# EAGLE design seismometer (EAGLE 7.0.0)
Placa Principal TGF-SIS001
AUTHOR: Ivan Pereira
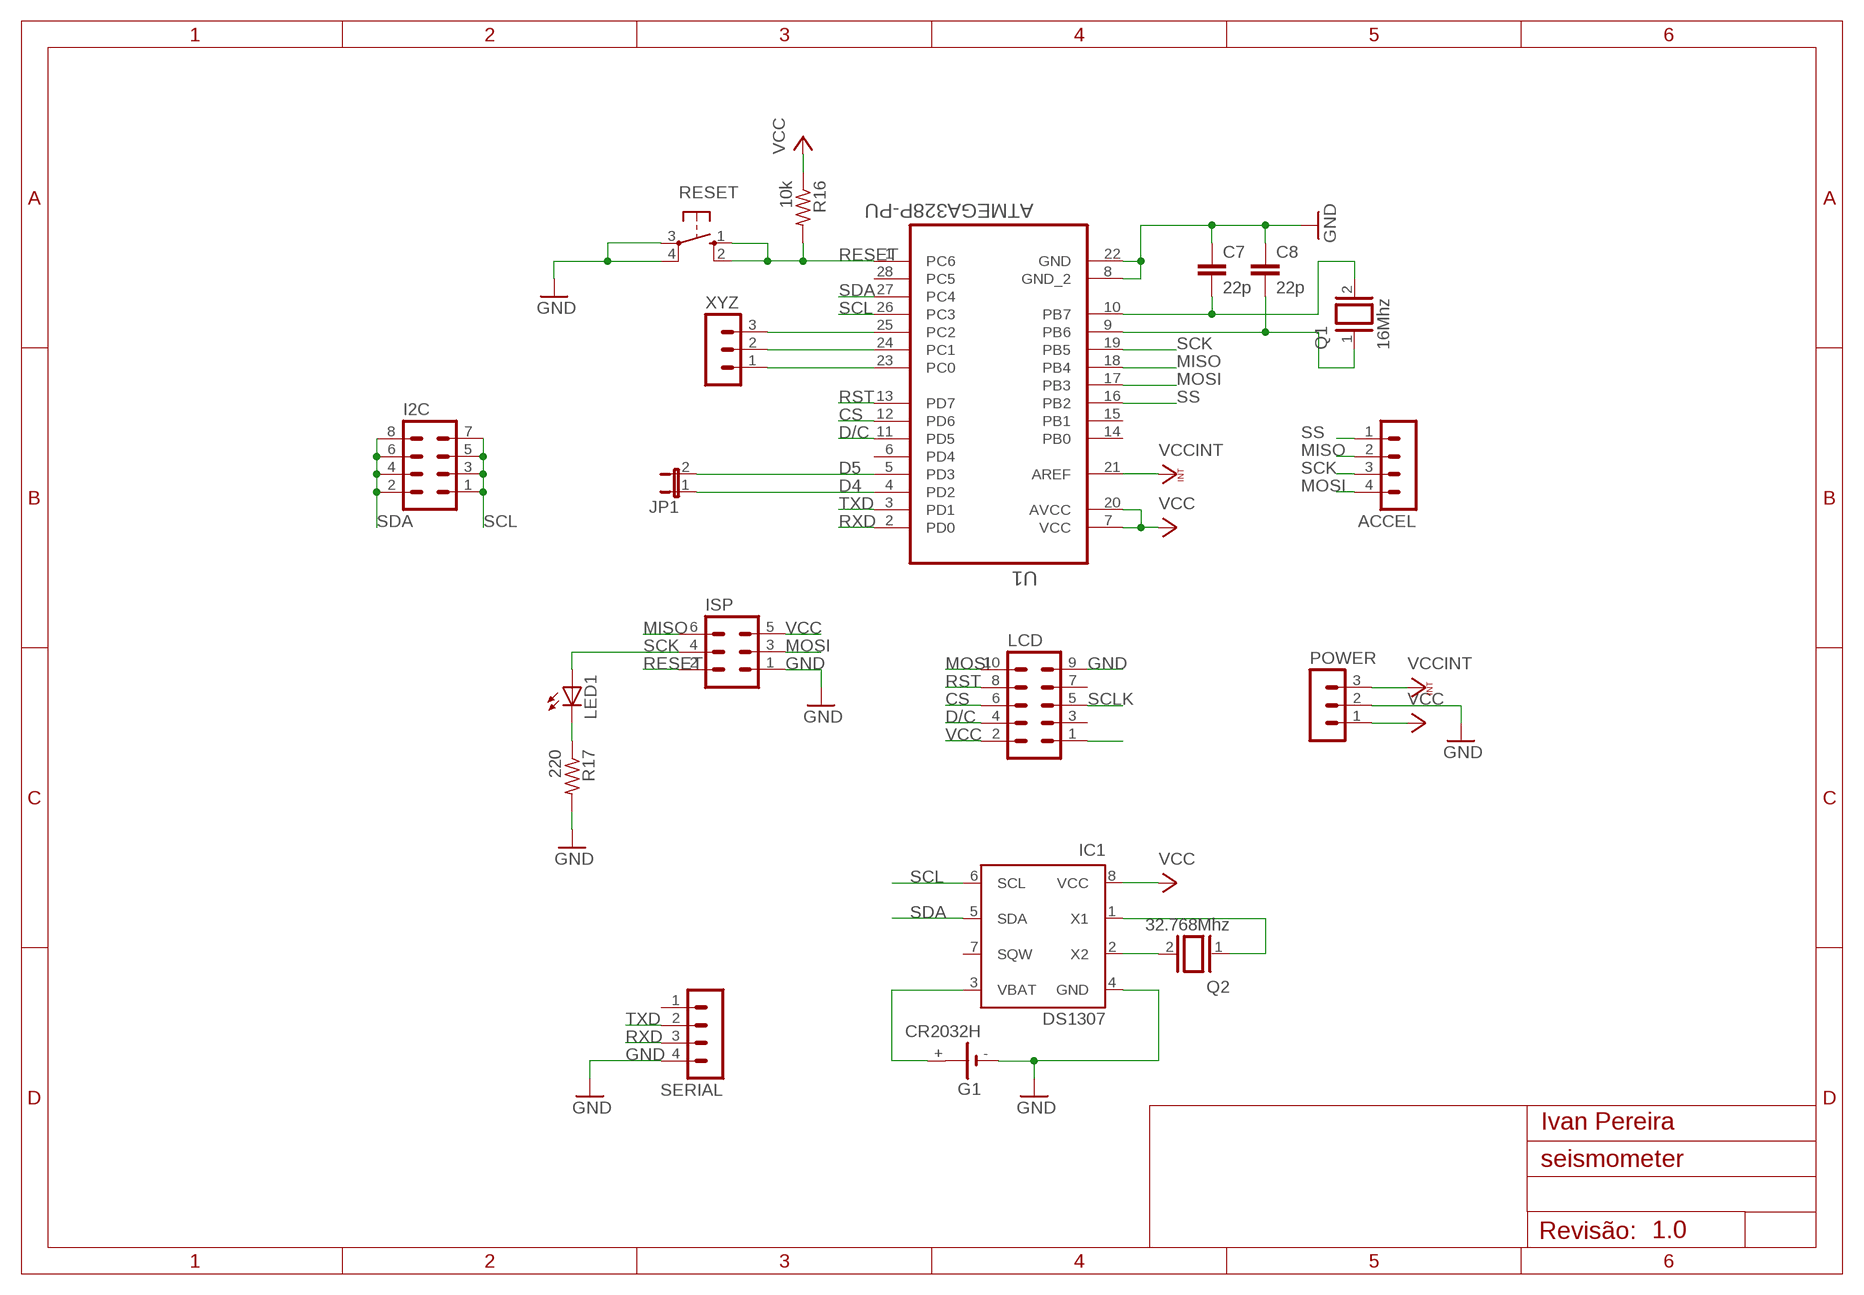
[diagram p0: schematic, sheet 1]
FRAME1 (A4L-LOC): AUTHOR: Ivan Pereira; REV: 1.0

## Parts
ACCEL  MA04-1  [MA04-1]
C7  22p  C-EU050-025X075  [C050-025X075]
C8  22p  C-EU050-025X075  [C050-025X075]
G1  CR2032H  [CR2032H]
I2C  MA04-2  [MA04-2]
IC1  DS1307  [DIL08]
ISP  MA03-2  [MA03-2]
JP1  JP1E  [JP1]
LCD  MA05-2  [MA05-2]
LED1  LED3MM  [LED3MM]
POWER  MA03-1  [MA03-1]
Q1  16Mhz  XTAL/S  [QS]
Q2  32.768Mhz  XTAL/S  [QS]
R16  10k  R-US_0207/12  [0207/12]
R17  220  R-US_0207/12  [0207/12]
RESET  10-XX  [B3F-10XX]
SERIAL  MA04-1  [MA04-1]
U1  ATMEGA328P-PU  [DIP254P762X457-28]
XYZ  MA03-1  [MA03-1]

## Nets
CS: LCD.6 U1.12(PD6)
D4: JP1.1 U1.4(PD2)
D5: JP1.2 U1.5(PD3)
D/C: LCD.4 U1.11(PD5)
GND: C7.1 C8.1 G1.- IC1.4(GND) ISP.1 LCD.9 POWER.2 R17.2 RESET.3(P) RESET.4(P1) SERIAL.4 U1.8(GND_2) U1.22(GND)
MISO: ACCEL.2 ISP.6 U1.18(PB4)
MOSI: ACCEL.4 ISP.3 LCD.10 U1.17(PB3)
N$1: U1.23(PC0) XYZ.1
N$2: LCD.1
N$3: U1.24(PC1) XYZ.2
N$4: U1.25(PC2) XYZ.3
N$22: C7.2 Q1.2 U1.10(PB7)
N$23: C8.2 Q1.1 U1.9(PB6)
N$25: IC1.1(X1) Q2.1
N$26: IC1.2(X2) Q2.2
N$28: G1.+ IC1.3(VBAT)
N$31: LED1.K(C) R17.1
RESET: ISP.2 R16.2 RESET.1(S) RESET.2(S1) U1.1(PC6)
RST: LCD.8 U1.13(PD7)
RXD: SERIAL.3 U1.2(PD0)
SCK: ACCEL.3 ISP.4 LED1.A U1.19(PB5)
SCL: I2C.1 I2C.3 I2C.5 I2C.7 IC1.6(SCL) U1.26(PC3)
SCLK: LCD.5
SDA: I2C.2 I2C.4 I2C.6 I2C.8 IC1.5(SDA) U1.27(PC4)
SS: ACCEL.1 U1.16(PB2)
TXD: SERIAL.2 U1.3(PD1)
VCC: IC1.8(VCC) ISP.5 LCD.2 POWER.1 R16.1 U1.7(VCC) U1.20(AVCC)
VCCINT: POWER.3 U1.21(AREF)
Unconnected: G1.+@1(+) IC1.7(SQW) LCD.3 LCD.7 SERIAL.1 U1.6(PD4) U1.14(PB0) U1.15(PB1) U1.28(PC5)

## Library data of the parts
ACCEL SERIAL = con-lstb:MA04-1: PIN HEADER; OC_FARNELL: unknown; OC_NEWARK: unknown
C7 C8 = rcl:C-EU: CAPACITOR, European symbol
G1 = battery:CR2032H: LI BATTERY Varta
I2C = con-lstb:MA04-2: PIN HEADER; OC_FARNELL: unknown; OC_NEWARK: unknown
IC1 = ds1307_pcf8583:DS1307: I2C-Bus CLOCK/CALENDAR
ISP = con-lstb:MA03-2: PIN HEADER; OC_FARNELL: unknown; OC_NEWARK: unknown
JP1 = jumper:JP1E: JUMPER
LCD = con-lstb:MA05-2: PIN HEADER; OC_FARNELL: unknown; OC_NEWARK: unknown
LED1 = adafruit:LED: LED OSRAM: - CHIPLED LG R971, LG N971, LY N971, LG Q971, LY Q971, LO R971, LY R971 LH N974, LH R974 LS Q976, LO Q976, LY Q976 LO Q996 - Hyper CHIPLED LW Q18S LB Q993, LB Q99A, LB R99A - SideLED LS A670, LO A670, LY A670, LG A670, LP A670 LB A673, LV A673, LT A673, LW A673 LH A674 LY A675 LS A676, LA A676, LO A676, LY A676, LW A676 LS A679, LY A679, LG A679 - Hyper Micro SIDELED® LS Y876, LA Y876, LO Y876, LY Y876 LT Y87S - SmartLED LW L88C, LW L88S LB L89C, LB L89S, LG L890 LS L89K, LO L89K, LY L89K LS L896, LA L896, LO L896, LY L896 - TOPLED LS T670, LO T670, LY T670, LG T670, LP T670 LSG T670, LSP T670, LSY T670, LOP T670, LYG T670 LG T671, LOG T671, LSG T671 LB T673, LV T673, LT T673, LW T673 LH T674 LS T676, LA T676, LO T676, LY T676, LB T676, LH T676, LSB T676, LW T676 LB T67C, LV T67C, LT T67C, LS T67K, LO T67K, LY T67K, LW E67C LS E67B, LA E67B, LO E67B, LY E67B, LB E67C, LV E67C, LT E67C LW T67C LS T679, LY T679, LG T679 LS T770, LO T770, LY T770, LG T770, LP T770 LB T773, LV T773, LT T773, LW T773 LH T774 LS E675, LA E675, LY E675, LS T675 LS T776, LA T776, LO T776, LY T776, LB T776 LHGB T686 LT T68C, LB T68C - Hyper Mini TOPLED® LB M676 - Mini TOPLED Santana® LG M470 LS M47K, LO M47K, LY M47K Source: http://www.osram.convergy.de/
POWER XYZ = con-lstb:MA03-1: PIN HEADER; OC_FARNELL: unknown; OC_NEWARK: unknown
Q1 Q2 = special:XTAL/S: CRYSTAL
R16 R17 = resistor:R-US_: RESISTOR, American symbol
RESET = switch-omron:10-XX: OMRON SWITCH; MPN: B3F-1000; OC_FARNELL: 176432; OC_NEWARK: 36M3542
U1 = Atmel_By_element14_Batch_1-00:ATMEGA328P-PU: 8-bit Microcontroller with In-System Programmable Flash; MPN: ATMEGA328P-PU; OC_FARNELL: 1715487; OC_NEWARK: 15R0268; PACKAGE: PDIP-28; SUPPLIER: Atmel

## Board
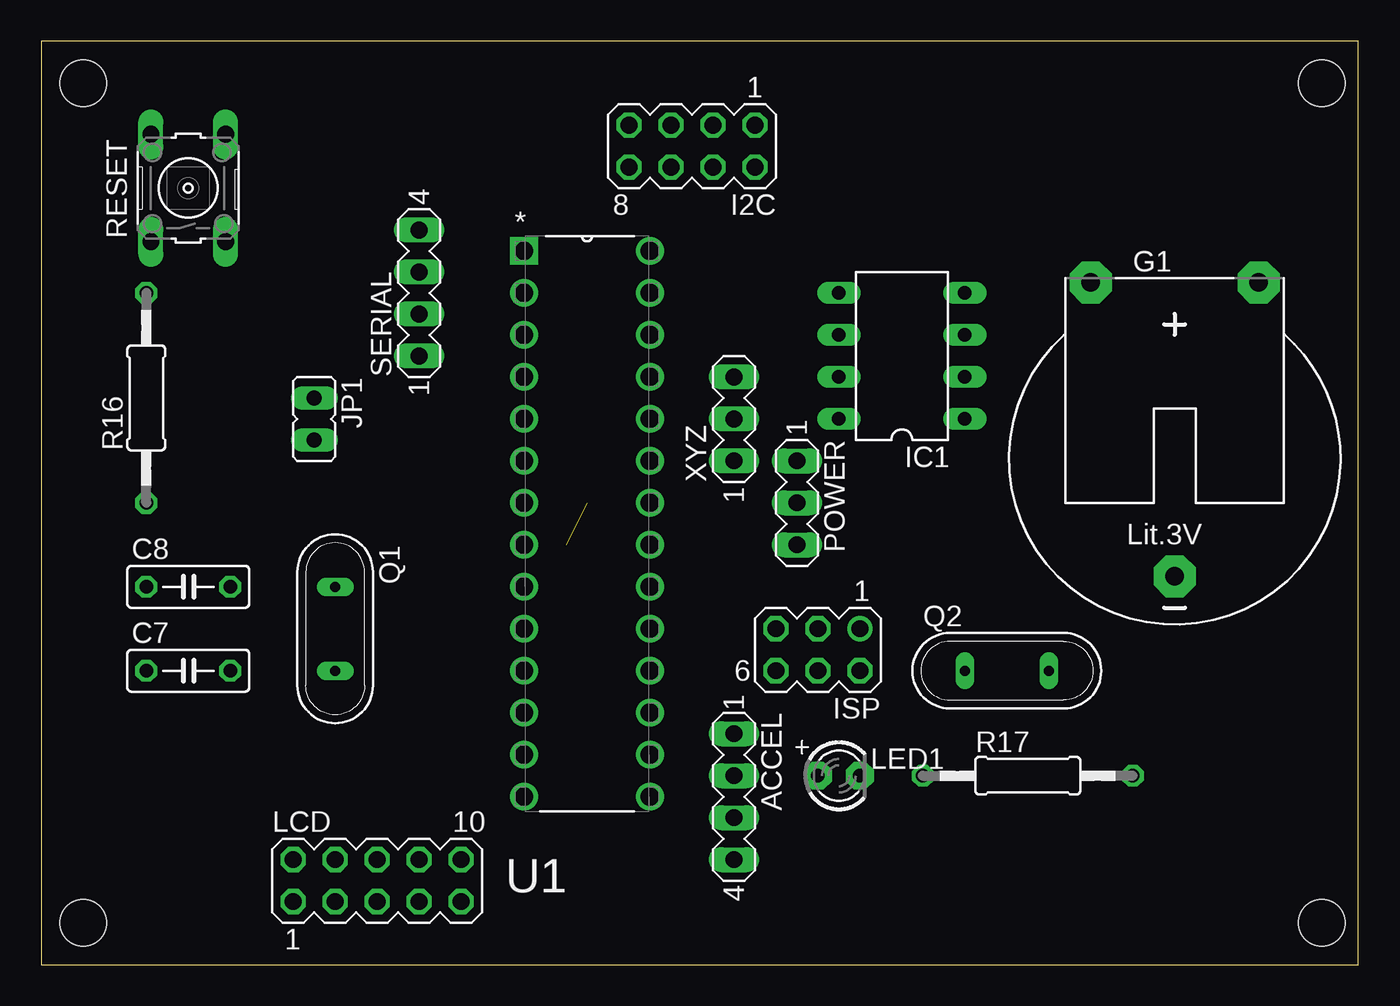
[diagram p1: board, top side]
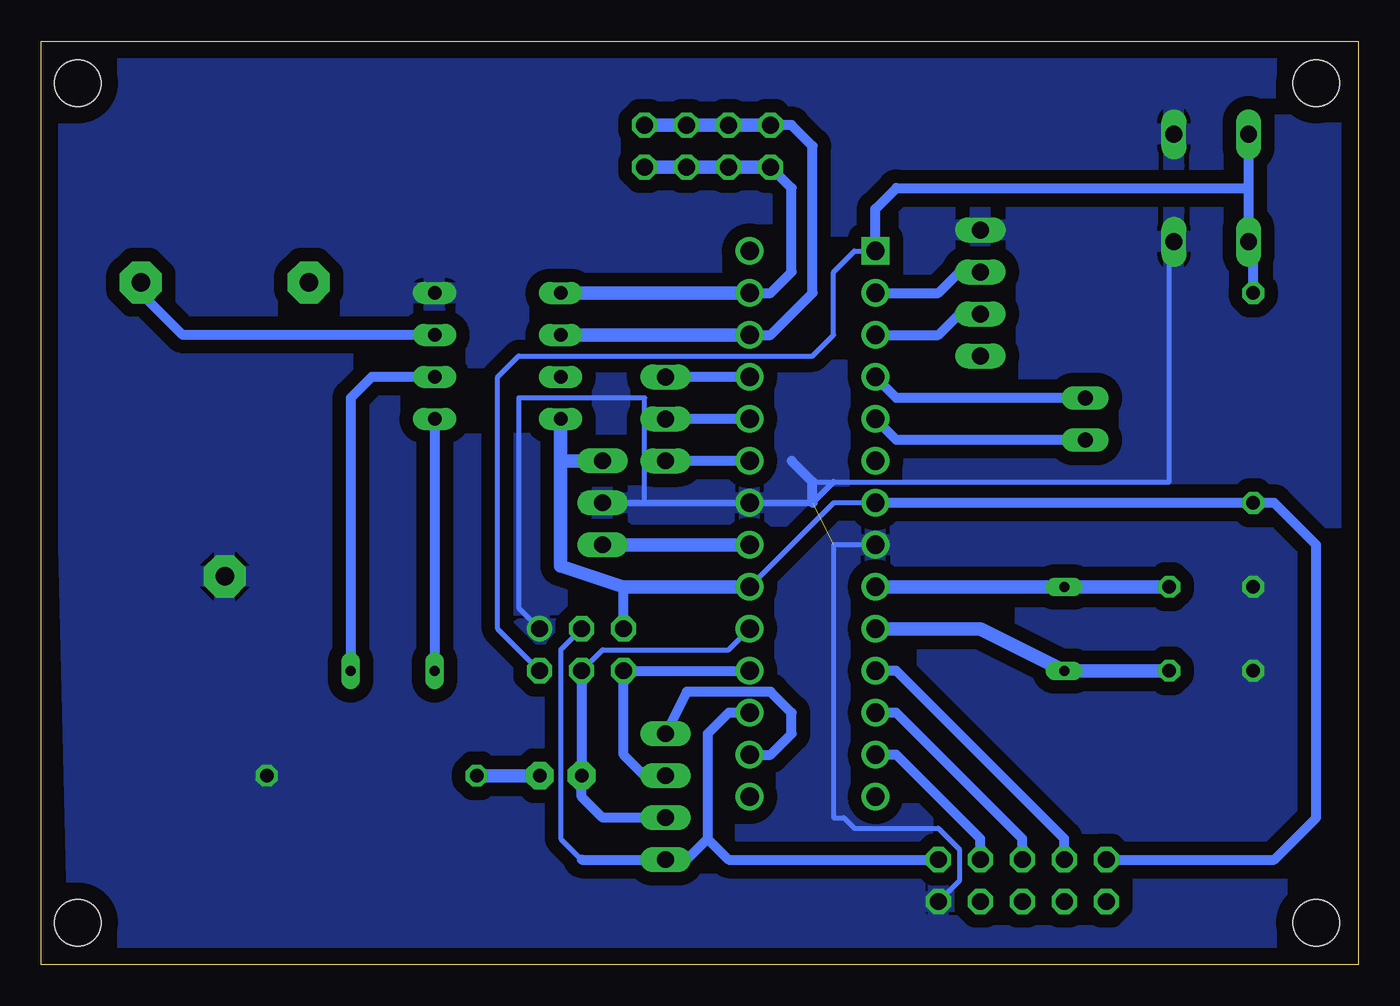
[diagram p2: board, bottom side, seen from below]

Size 79.68 x 55.87 mm. Coordinates in mm from the lower left corner, seen from the top.
Outline: 0,0 79.68,0 79.68,55.87 0,55.87 0,0
Copper layers (1*16): Top 0.035mm / dielectric 1.5mm / Bottom 0.035mm
Design rules "default": minimum track width 10mil, minimum drill 24mil, track to track 8mil, track to pad 8mil, pad to pad 8mil, via to via 8mil, smd to smd 8mil, copper to edge 40mil, drill to drill 8mil, minimum pad ring 10mil, minimum via ring 8mil, stop-mask expansion 4mil, vias tented up to drill 0mil, thermal gap 10mil
Holes 2.8 mm at 2.54,2.54 77.47,2.54 77.47,53.34 2.54,53.34

### Footprints (pad centres in the part's own frame; a part is rotated, then mirrored left to right if it is on the bottom)
MA04-1 = drill 1.016 long: 1 -3.81,0; 2 -1.27,0; 3 1.27,0; 4 3.81,0
C050-025X075 = drill 0.813 octagon: 1 -2.54,0; 2 2.54,0
CR2032H = drill 1.118 pad 2.54 octagon: + 5.08,10.795; +@1 -5.08,10.795; - 0,-6.985
MA04-2 = drill 1.016 octagon: 1 -3.81,-1.27; 2 -3.81,1.27; 3 -1.27,-1.27; 4 -1.27,1.27; 5 1.27,-1.27; 6 1.27,1.27; 7 3.81,-1.27; 8 3.81,1.27
DIL08 = drill 0.813 long: 1 -3.81,-3.81; 2 -1.27,-3.81; 3 1.27,-3.81; 4 3.81,-3.81; 5 3.81,3.81; 6 1.27,3.81; 7 -1.27,3.81; 8 -3.81,3.81
MA03-2 = drill 1.016: 1 -2.54,-1.27 | drill 1.016 octagon: 2 -2.54,1.27; 3 0,-1.27; 4 0,1.27; 5 2.54,-1.27; 6 2.54,1.27
JP1 = drill 0.914 long: 1 0,-1.27; 2 0,1.27
MA05-2 = drill 1.016 octagon: 1 -5.08,-1.27; 2 -5.08,1.27; 3 -2.54,-1.27; 4 -2.54,1.27; 5 0,-1.27; 6 0,1.27; 7 2.54,-1.27; 8 2.54,1.27; 9 5.08,-1.27; 10 5.08,1.27
LED3MM = drill 0.813 pad 1.676 octagon: A -1.27,0; K 1.27,0
MA03-1 = drill 1.016 long: 1 -2.54,0; 2 0,0; 3 2.54,0
QS = drill 0.61 long: 1 -2.54,0; 2 2.54,0
0207/12 = drill 0.813 octagon: 1 -6.35,0; 2 6.35,0
B3F-10XX = drill 1.016 long: 1 -3.251,2.261; 2 3.251,2.261; 3 -3.251,-2.261; 4 3.251,-2.261
DIP254P762X457-28 = drill 1.118 square: 1 -7.62,33.02 | drill 1.118: 2 -7.62,30.48; 3 -7.62,27.94; 4 -7.62,25.4; 5 -7.62,22.86; 6 -7.62,20.32; 7 -7.62,17.78; 8 -7.62,15.24; 9 -7.62,12.7; 10 -7.62,10.16; 11 -7.62,7.62; 12 -7.62,5.08; 13 -7.62,2.54; 14 -7.62,0; 15 0,0; 16 0,2.54; 17 0,5.08; 18 0,7.62; 19 0,10.16; 20 0,12.7; 21 0,15.24; 22 0,17.78; 23 0,20.32; 24 0,22.86; 25 0,25.4; 26 0,27.94; 27 0,30.48; 28 0,33.02

### Placement (x,y rotation side)
ACCEL  41.91,10.16 270 top
C7  8.89,17.78 0 top
C8  8.89,22.86 0 top
G1  68.58,30.48 0 top
I2C  39.37,49.53 180 top
IC1  52.07,36.83 90 top
ISP  46.99,19.05 180 top
JP1  16.51,33.02 180 top
LCD  20.32,5.08 0 top
LED1  48.26,11.43 0 top
POWER  45.72,27.94 270 top
Q1  17.78,20.32 270 top
Q2  58.42,17.78 0 top
R16  6.35,34.29 90 top
R17  59.69,11.43 0 top
RESET  8.89,46.99 90 top
SERIAL  22.86,40.64 90 top
U1  36.83,10.16 0 top
XYZ  41.91,33.02 90 top

### Tracks (layer width: path | path; a pad name or v marks a point on that pad's centre or on a via)
CS
  Bottom 0.61: LCD.6 20.32,7.62 27.94,15.24 U1.12
D4
  Bottom 0.61: JP1.1 27.94,34.29 U1.4
D5
  Bottom 0.61: JP1.2 27.94,31.75 U1.5
D/C
  Bottom 0.61: LCD.4 17.78,7.62 27.94,17.78 U1.11
GND  (1 unrouted)
  Bottom 0.305: 33.02,29.21 11.43,29.21 11.43,43.46 RESET.3 | 43.18,27.94 43.18,34.29 50.8,34.29 50.8,21.59 ISP.1 | U1.8 31.75,25.4 31.75,8.89 31.11,8.89 30.48,8.26 25.4,8.26 24.13,6.99 24.13,5.08 LCD.9
  Bottom 0.406: POWER.2 43.18,27.94 U1.22 33.02,27.94 31.75,29.21
  Bottom 0.61: 33.02,27.94 33.02,29.21 34.29,30.48
  pour Bottom (isolate 0.813): 1.27,54.61 78.74,54.61 77.47,1.27 1.27,1.27
MISO
  Bottom 0.61: U1.18 ISP.6 44.45,12.7 43.18,11.43 ACCEL.2
MOSI
  Bottom 0.305: ISP.3 48.26,19.05 48.26,7.62 46.99,6.35
  Bottom 0.61: U1.17 38.1,15.24 39.37,13.97 39.37,7.62 | 39.37,7.62 38.1,6.35 LCD.10 | 46.99,6.35 ACCEL.4 40.64,6.35 39.37,7.62
N$1
  Bottom 0.61: U1.23 XYZ.1
N$3
  Bottom 0.61: U1.24 XYZ.2
N$4
  Bottom 0.61: U1.25 XYZ.3
N$22
  Bottom 0.813: C7.2 Q1.2 22.86,20.32 U1.10
N$23
  Bottom 0.813: C8.2 Q1.1 U1.9
N$25
  Bottom 0.61: IC1.1 Q2.1
N$26
  Bottom 0.61: IC1.2 59.69,35.56 60.96,34.29 Q2.2
N$28
  Bottom 0.61: IC1.3 71.12,38.1 73.66,40.64 G1.+
N$31
  Bottom 0.813: LED1.K R17.1
RESET
  Bottom 0.305: ISP.2 52.07,20.32 52.07,35.56 50.8,36.83 33.02,36.83 31.75,38.1 31.75,41.91 30.48,43.18 U1.1
  Bottom 0.61: 6.63,46.99 RESET.1 6.35,43.46 R16.2 | 6.63,46.99 RESET.2 | U1.1 29.21,45.72 27.94,46.99 6.63,46.99
RST
  Bottom 0.61: LCD.8 22.86,7.62 27.94,12.7 U1.13
RXD
  Bottom 0.61: U1.2 25.4,40.64 24.13,41.91 SERIAL.3
SCK
  Bottom 0.305: ISP.4 45.72,19.05 38.1,19.05 U1.19
  Bottom 0.61: ISP.4 LED1.A 46.99,10.16 45.72,8.89 ACCEL.3
SCL
  Bottom 0.61: U1.26 35.56,38.1 33.02,40.64 33.02,49.53 34.29,50.8 I2C.7
  Bottom 0.813: IC1.6 U1.26 | I2C.1 I2C.3 I2C.5 I2C.7
SDA
  Bottom 0.61: U1.27 35.56,40.64 34.29,41.91 34.29,46.99 I2C.8
  Bottom 0.813: U1.27 IC1.5 | I2C.2 I2C.4 I2C.6 I2C.8
SS
  Bottom 0.61: U1.16 35.56,12.7 34.29,13.97 34.29,15.24 35.56,16.51 40.64,16.51 ACCEL.1
TXD
  Bottom 0.61: U1.3 25.4,38.1 24.13,39.37 SERIAL.2
VCC
  Bottom 0.305: U1.7 31.75,27.94 U1.20
  Bottom 0.61: LCD.2 5.08,6.35 2.54,8.89 2.54,25.4 5.08,27.94 R16.1 U1.7 | ISP.5 44.45,22.86
  Bottom 0.813: POWER.1 48.26,30.48 | 48.26,30.48 IC1.8 | U1.20 44.45,22.86 48.26,24.13 48.26,30.48
VCCINT
  Bottom 0.813: U1.21 POWER.3